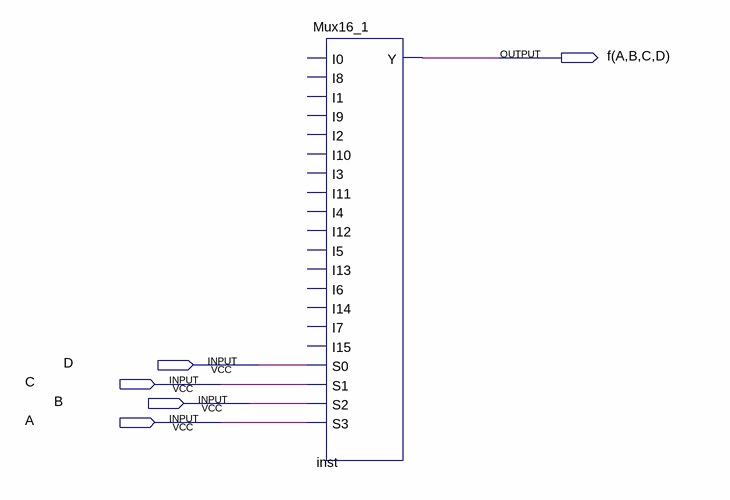
[diagram p0: schematic sheet]
// Quartus schematic Block5.bdf as structural Verilog: 1 symbols, 5 pins
module Block5 (
  input  D,
  inout  C,
  inout  B,
  input  A,
  output \f(A ,
  output \D) 
);

  wire inst_y;

  Mux16_1 inst (
    .S0(D), .S1(C), .S2(B), .S3(A), .Y(inst_y));  // open: I0, I8, I1, I9, I2, I10, I3, I11, I4, I12, I5, I13, I6, I14, I7, I15
endmodule
